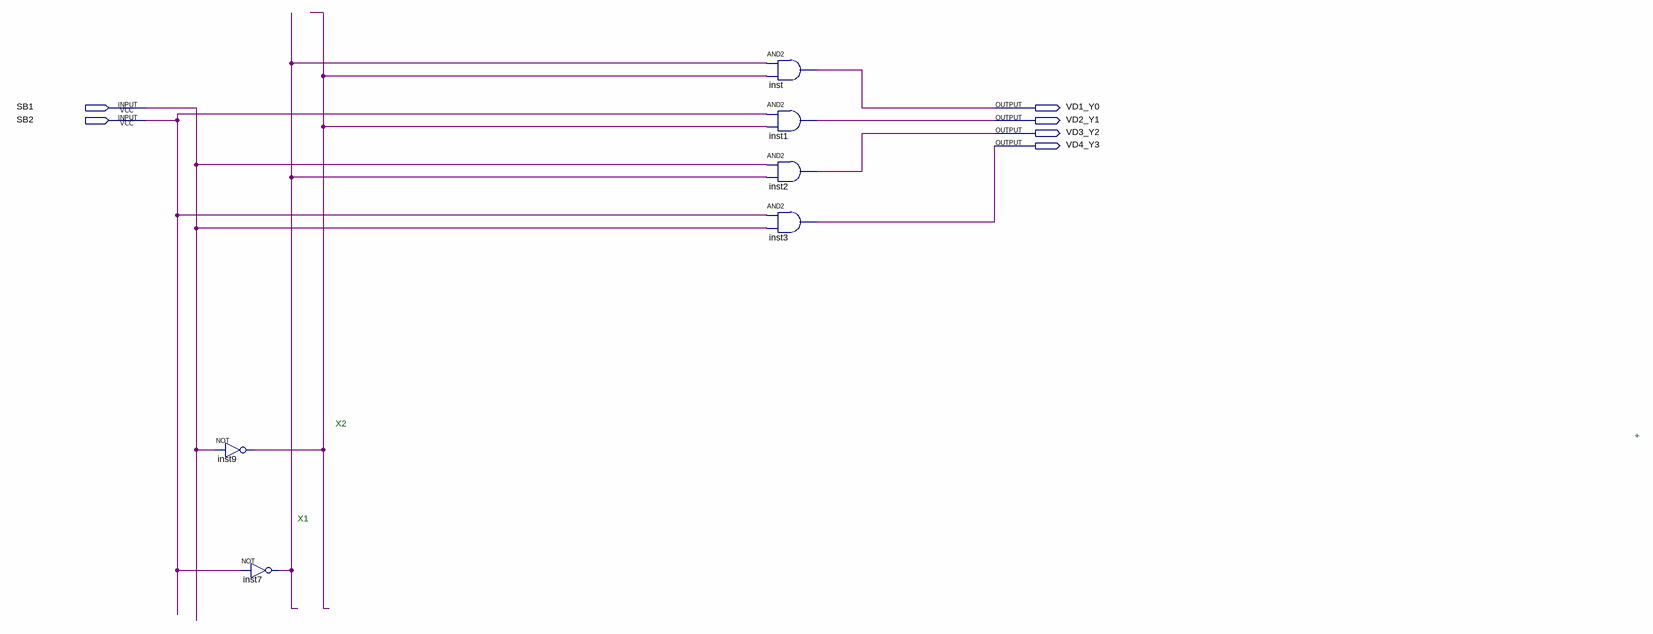
[diagram p0: schematic sheet]
// Quartus schematic lab.bdf as structural Verilog: 6 symbols, 6 pins
module lab (
  input  SB1,
  input  SB2,
  output VD1_Y0,
  output VD2_Y1,
  output VD3_Y2,
  output VD4_Y3
);

  wire inst7_out, inst9_out;

  not inst9 (inst9_out, SB1);
  not inst7 (inst7_out, SB2);
  and inst (VD1_Y0, inst7_out, inst9_out);
  and inst1 (VD2_Y1, SB2, inst9_out);
  and inst2 (VD3_Y2, SB1, inst7_out);
  and inst3 (VD4_Y3, SB2, SB1);

  // Notes on the sheet:
  //   X2
  //   +
  //   X1
endmodule
